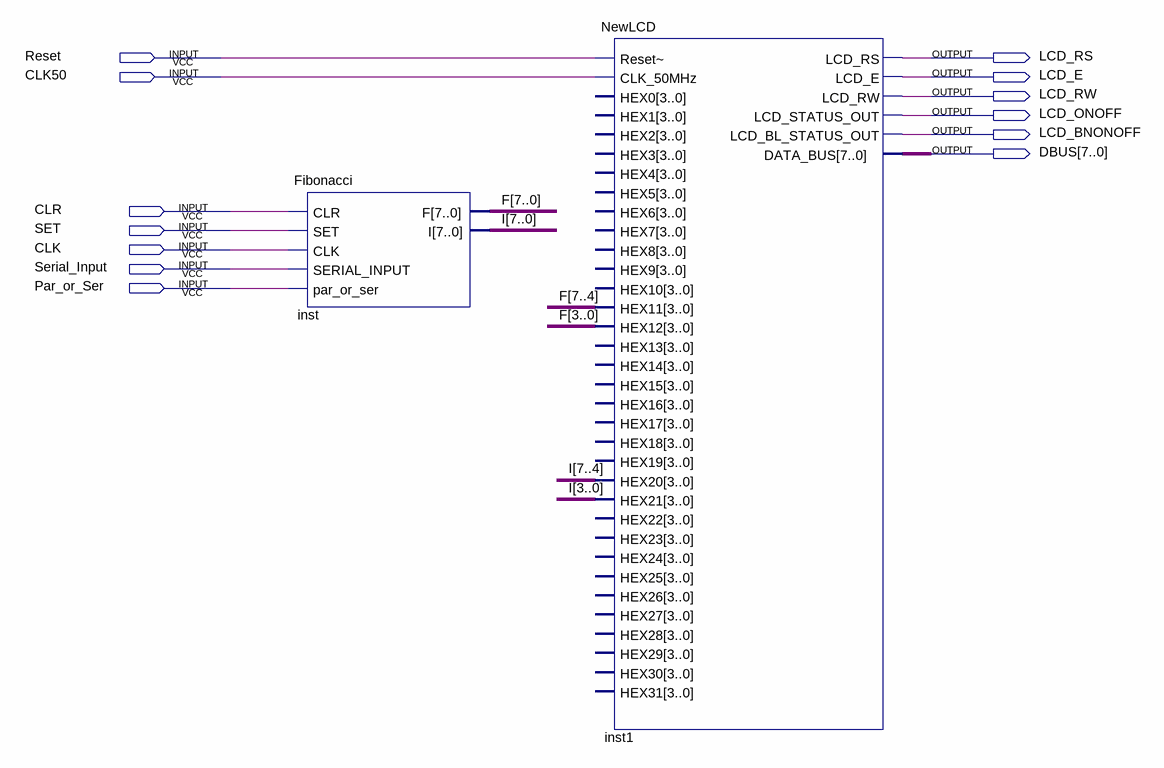
[diagram p0: schematic sheet]
// Quartus schematic FibonacciLCD.bdf as structural Verilog: 2 symbols, 13 pins
module FibonacciLCD (
  input  Reset,
  input  CLK50,
  input  CLR,
  input  SET,
  input  CLK,
  input  Serial_Input,
  input  Par_or_Ser,
  output LCD_RS,
  output LCD_E,
  output LCD_RW,
  output LCD_ONOFF,
  output LCD_BNONOFF,
  output [7:0] DBUS
);

  wire [7:0] F, I;

  Fibonacci inst (.CLR(CLR), .SET(SET), .CLK(CLK), .SERIAL_INPUT(Serial_Input), .par_or_ser(Par_or_Ser), .F(F), .I(I));
  NewLCD inst1 (
    .\Reset~ (Reset), .CLK_50MHz(CLK50), .HEX11(F[7:4]), .HEX12(F[3:0]), .HEX20(I[7:4]), .HEX21(I[3:0]),
    .LCD_RS(LCD_RS), .LCD_E(LCD_E), .LCD_RW(LCD_RW), .LCD_STATUS_OUT(LCD_ONOFF),
    .LCD_BL_STATUS_OUT(LCD_BNONOFF), .DATA_BUS(DBUS));  // open: HEX0, HEX1, HEX2, HEX3, HEX4, HEX5, HEX6, HEX7, HEX8, HEX9, HEX10, HEX13, HEX14, HEX15, HEX16, HEX17, HEX18, HEX19, HEX22, HEX23, HEX24, HEX25, HEX26, HEX27, HEX28, HEX29, HEX30, HEX31
endmodule
